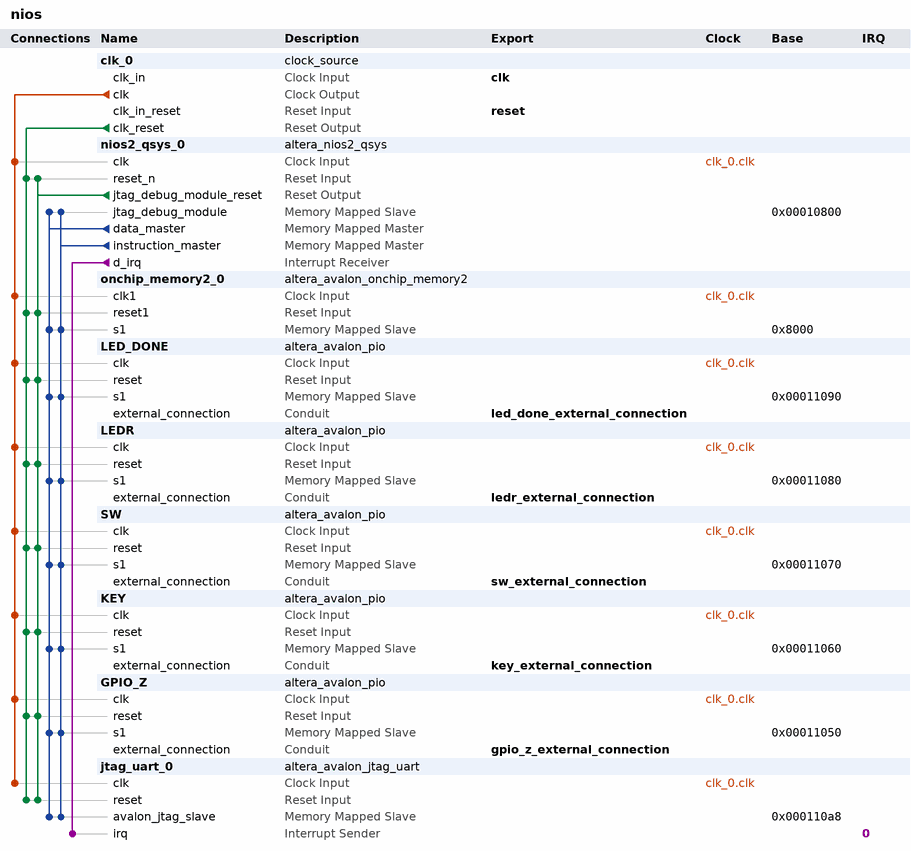
[diagram p0: system contents]
# Platform Designer (Qsys) system nios, Cyclone IV E EP4CE115F29C7
# Parameters at their usual value, and those the tool derives, are not listed.
package require -exact qsys 18.1
create_system nios
set_project_property DEVICE_FAMILY {Cyclone IV E}
set_project_property DEVICE EP4CE115F29C7

add_instance clk_0 clock_source 18.1
set_instance_parameter_value clk_0 clockFrequency 50000000

add_instance nios2_qsys_0 altera_nios2_qsys 16.1
set_instance_parameter_value nios2_qsys_0 breakSlave nios2_qsys_0.jtag_debug_module
set_instance_parameter_value nios2_qsys_0 exceptionSlave onchip_memory2_0.s1
set_instance_parameter_value nios2_qsys_0 icache_size 4096
set_instance_parameter_value nios2_qsys_0 impl Tiny
set_instance_parameter_value nios2_qsys_0 mmu_TLBMissExcSlave None
set_instance_parameter_value nios2_qsys_0 resetSlave onchip_memory2_0.s1
set_instance_parameter_value nios2_qsys_0 resetrequest_enabled true

add_instance onchip_memory2_0 altera_avalon_onchip_memory2 18.1
set_instance_parameter_value onchip_memory2_0 dataWidth 32
set_instance_parameter_value onchip_memory2_0 dualPort false
set_instance_parameter_value onchip_memory2_0 initMemContent true
set_instance_parameter_value onchip_memory2_0 initializationFileName onchip_mem.hex
set_instance_parameter_value onchip_memory2_0 memorySize 20480

add_instance LED_DONE altera_avalon_pio 18.1
set_instance_parameter_value LED_DONE direction Output
set_instance_parameter_value LED_DONE width 1

add_instance LEDR altera_avalon_pio 18.1
set_instance_parameter_value LEDR direction Output
set_instance_parameter_value LEDR width 4

add_instance SW altera_avalon_pio 18.1
set_instance_parameter_value SW direction Input
set_instance_parameter_value SW width 4

add_instance KEY altera_avalon_pio 18.1
set_instance_parameter_value KEY direction Input
set_instance_parameter_value KEY width 2

add_instance GPIO_Z altera_avalon_pio 18.1
set_instance_parameter_value GPIO_Z direction Output
set_instance_parameter_value GPIO_Z width 4

add_instance jtag_uart_0 altera_avalon_jtag_uart 18.1
set_instance_parameter_value jtag_uart_0 simInteractiveOptions NO_INTERACTIVE_WINDOWS

# connections
add_connection clk_0.clk GPIO_Z.clk clock
add_connection clk_0.clk jtag_uart_0.clk clock
add_connection clk_0.clk KEY.clk clock
add_connection clk_0.clk LED_DONE.clk clock
add_connection clk_0.clk LEDR.clk clock
add_connection clk_0.clk nios2_qsys_0.clk clock
add_connection clk_0.clk onchip_memory2_0.clk1 clock
add_connection clk_0.clk SW.clk clock
add_connection clk_0.clk_reset GPIO_Z.reset reset
add_connection clk_0.clk_reset jtag_uart_0.reset reset
add_connection clk_0.clk_reset KEY.reset reset
add_connection clk_0.clk_reset LED_DONE.reset reset
add_connection clk_0.clk_reset LEDR.reset reset
add_connection clk_0.clk_reset nios2_qsys_0.reset_n reset
add_connection clk_0.clk_reset onchip_memory2_0.reset1 reset
add_connection clk_0.clk_reset SW.reset reset
add_connection nios2_qsys_0.jtag_debug_module_reset GPIO_Z.reset reset
add_connection nios2_qsys_0.jtag_debug_module_reset jtag_uart_0.reset reset
add_connection nios2_qsys_0.jtag_debug_module_reset KEY.reset reset
add_connection nios2_qsys_0.jtag_debug_module_reset LED_DONE.reset reset
add_connection nios2_qsys_0.jtag_debug_module_reset LEDR.reset reset
add_connection nios2_qsys_0.jtag_debug_module_reset nios2_qsys_0.reset_n reset
add_connection nios2_qsys_0.jtag_debug_module_reset onchip_memory2_0.reset1 reset
add_connection nios2_qsys_0.jtag_debug_module_reset SW.reset reset
add_connection nios2_qsys_0.data_master GPIO_Z.s1 avalon
set_connection_parameter_value nios2_qsys_0.data_master/GPIO_Z.s1 baseAddress 0x00011050
add_connection nios2_qsys_0.data_master jtag_uart_0.avalon_jtag_slave avalon
set_connection_parameter_value nios2_qsys_0.data_master/jtag_uart_0.avalon_jtag_slave baseAddress 0x000110a8
add_connection nios2_qsys_0.data_master KEY.s1 avalon
set_connection_parameter_value nios2_qsys_0.data_master/KEY.s1 baseAddress 0x00011060
add_connection nios2_qsys_0.data_master LED_DONE.s1 avalon
set_connection_parameter_value nios2_qsys_0.data_master/LED_DONE.s1 baseAddress 0x00011090
add_connection nios2_qsys_0.data_master LEDR.s1 avalon
set_connection_parameter_value nios2_qsys_0.data_master/LEDR.s1 baseAddress 0x00011080
add_connection nios2_qsys_0.data_master nios2_qsys_0.jtag_debug_module avalon
set_connection_parameter_value nios2_qsys_0.data_master/nios2_qsys_0.jtag_debug_module baseAddress 0x00010800
add_connection nios2_qsys_0.data_master onchip_memory2_0.s1 avalon
set_connection_parameter_value nios2_qsys_0.data_master/onchip_memory2_0.s1 baseAddress 0x8000
add_connection nios2_qsys_0.data_master SW.s1 avalon
set_connection_parameter_value nios2_qsys_0.data_master/SW.s1 baseAddress 0x00011070
add_connection nios2_qsys_0.instruction_master GPIO_Z.s1 avalon
set_connection_parameter_value nios2_qsys_0.instruction_master/GPIO_Z.s1 baseAddress 0x00011050
add_connection nios2_qsys_0.instruction_master jtag_uart_0.avalon_jtag_slave avalon
set_connection_parameter_value nios2_qsys_0.instruction_master/jtag_uart_0.avalon_jtag_slave baseAddress 0x000110a8
add_connection nios2_qsys_0.instruction_master KEY.s1 avalon
set_connection_parameter_value nios2_qsys_0.instruction_master/KEY.s1 baseAddress 0x00011060
add_connection nios2_qsys_0.instruction_master LED_DONE.s1 avalon
set_connection_parameter_value nios2_qsys_0.instruction_master/LED_DONE.s1 baseAddress 0x00011090
add_connection nios2_qsys_0.instruction_master LEDR.s1 avalon
set_connection_parameter_value nios2_qsys_0.instruction_master/LEDR.s1 baseAddress 0x00011080
add_connection nios2_qsys_0.instruction_master nios2_qsys_0.jtag_debug_module avalon
set_connection_parameter_value nios2_qsys_0.instruction_master/nios2_qsys_0.jtag_debug_module baseAddress 0x00010800
add_connection nios2_qsys_0.instruction_master onchip_memory2_0.s1 avalon
set_connection_parameter_value nios2_qsys_0.instruction_master/onchip_memory2_0.s1 baseAddress 0x8000
add_connection nios2_qsys_0.instruction_master SW.s1 avalon
set_connection_parameter_value nios2_qsys_0.instruction_master/SW.s1 baseAddress 0x00011070
add_connection nios2_qsys_0.d_irq jtag_uart_0.irq interrupt
set_connection_parameter_value nios2_qsys_0.d_irq/jtag_uart_0.irq irqNumber 0

# exported interfaces
add_interface clk clock sink
set_interface_property clk EXPORT_OF clk_0.clk_in
add_interface gpio_z_external_connection conduit end
set_interface_property gpio_z_external_connection EXPORT_OF GPIO_Z.external_connection
add_interface key_external_connection conduit end
set_interface_property key_external_connection EXPORT_OF KEY.external_connection
add_interface led_done_external_connection conduit end
set_interface_property led_done_external_connection EXPORT_OF LED_DONE.external_connection
add_interface ledr_external_connection conduit end
set_interface_property ledr_external_connection EXPORT_OF LEDR.external_connection
add_interface reset reset sink
set_interface_property reset EXPORT_OF clk_0.clk_in_reset
add_interface sw_external_connection conduit end
set_interface_property sw_external_connection EXPORT_OF SW.external_connection

set_interconnect_requirement {$system} qsys_mm.clockCrossingAdapter HANDSHAKE
set_interconnect_requirement {$system} qsys_mm.enableEccProtection FALSE
set_interconnect_requirement {$system} qsys_mm.insertDefaultSlave FALSE
set_interconnect_requirement {$system} qsys_mm.maxAdditionalLatency 1

save_system nios.qsys
